# Altium schematic sheet Controller.SchDoc
size A4; SheetNumber: 3; SheetTotal: 3
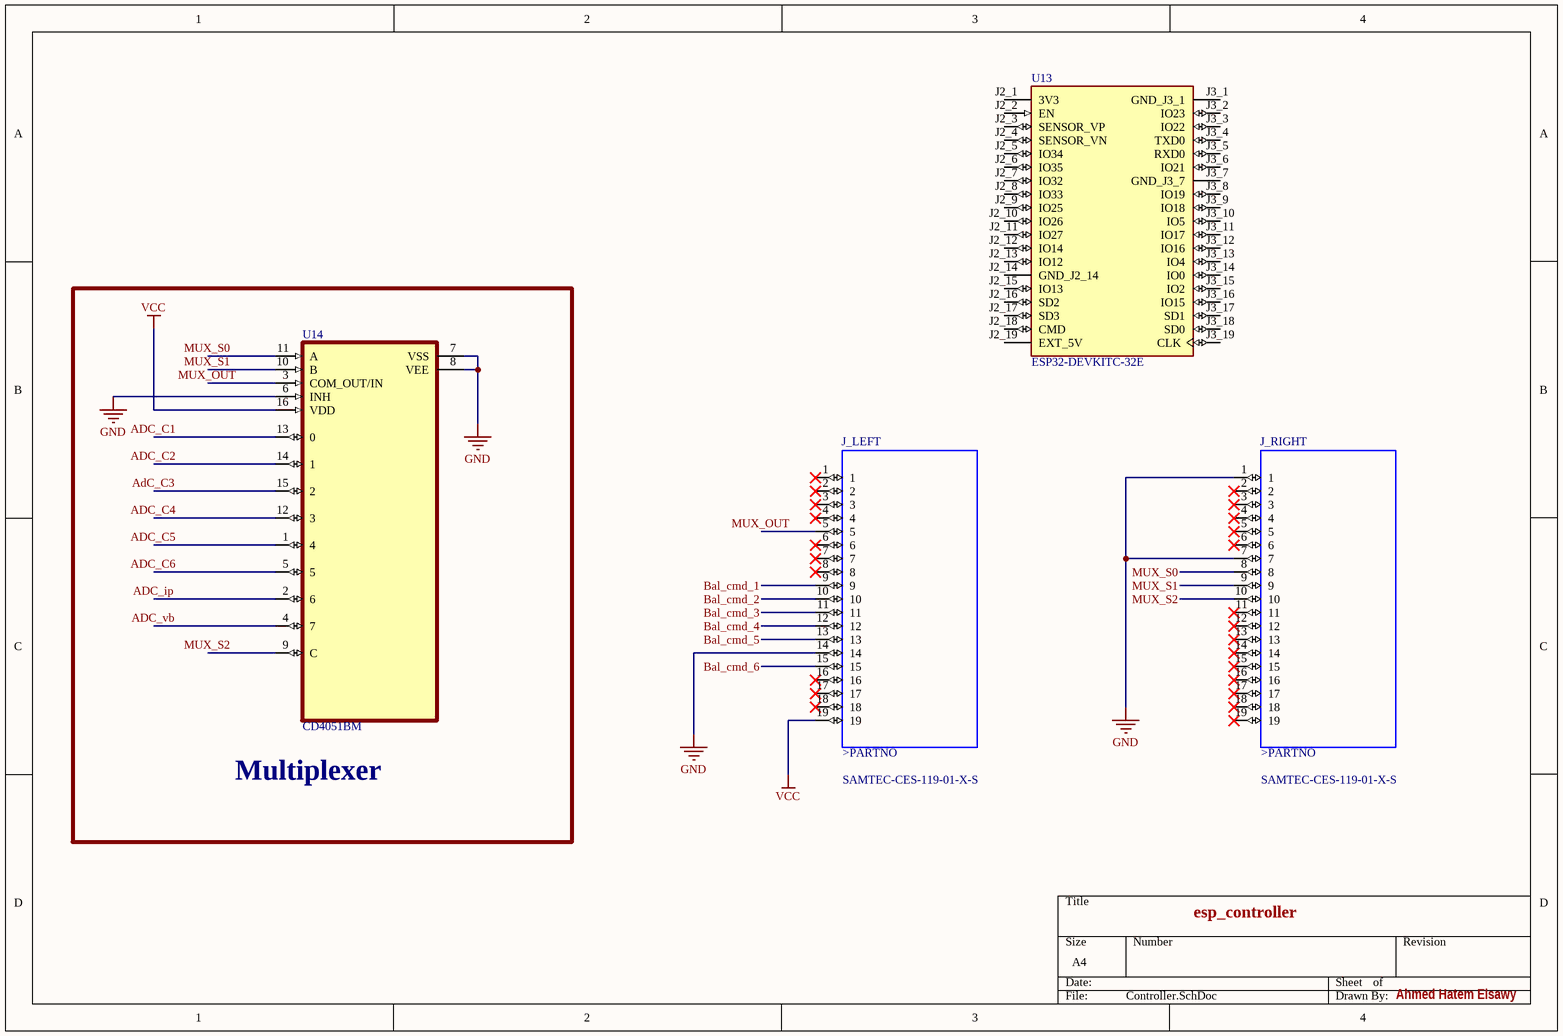
[diagram p0: Controller.SchDoc]

## Parts
J_LEFT  SAMTEC-CES-119-01-X-S  [SAMTEC-CES-119-01-X-S]  (value not drawn)
J_RIGHT  SAMTEC-CES-119-01-X-S  [SAMTEC-CES-119-01-X-S]  (value not drawn)
U13  ESP32-DEVKITC-32E  [MODULE_ESP32-DEVKITC-32E]
U14  CD4051BM  [SOIC127P600X175-16N]

## Blocks framed on the sheet
Multiplexer: U14

## Nets
GND: J_LEFT.14 J_RIGHT.1 J_RIGHT.7 U14.6(INH) U14.7(VSS) U14.8(VEE)
VCC: J_LEFT.19 U14.16(VDD)
ADC_C1: U14.13(0)
ADC_C2: U14.14(1)
AdC_C3: U14.15(2)
ADC_C4: U14.12(3)
ADC_C5: U14.1(4)
ADC_C6: U14.5
ADC_ip: U14.2(6)
ADC_vb: U14.4(7)
Bal_cmd_1: J_LEFT.9
Bal_cmd_2: J_LEFT.10
Bal_cmd_3: J_LEFT.11
Bal_cmd_4: J_LEFT.12
Bal_cmd_5: J_LEFT.13
Bal_cmd_6: J_LEFT.15
MUX_OUT: J_LEFT.5 U14.3(COM_OUT/IN)
MUX_S0: J_RIGHT.8 U14.11(A)
MUX_S1: J_RIGHT.9 U14.10(B)
MUX_S2: J_RIGHT.10 U14.9(C)

Not connected (* = marked no-connect by the designer): J_LEFT 1* 2* 3* 4* 6* 7* 8* 16* 17* 18*; J_RIGHT 2* 3* 4* 5* 6* 11* 12* 13* 14* 15* 16* 17* 18* 19*; U13 J2_1(3V3) J2_2(EN) J2_3(SENSOR_VP) J2_4(SENSOR_VN) J2_5(IO34) J2_6(IO35) J2_7(IO32) J2_8(IO33) J2_9(IO25) J2_10(IO26) J2_11(IO27) J2_12(IO14) J2_13(IO12) J2_14(GND_J2_14) J2_15(IO13) J2_16(SD2) J2_17(SD3) J2_18(CMD) J2_19(EXT_5V) J3_1(GND_J3_1) J3_2(IO23) J3_3(IO22) J3_4(TXD0) J3_5(RXD0) J3_6(IO21) J3_7(GND_J3_7) J3_8(IO19) J3_9(IO18) J3_10(IO5) J3_11(IO17) J3_12(IO16) J3_13(IO4) J3_14(IO0) J3_15(IO2) J3_16(IO15) J3_17(SD1) J3_18(SD0) J3_19(CLK)

## Notes on the sheet
- esp_controller
- Ahmed Hatem Elsawy
- (in symbol SAMTEC-CES-119-01-X-S) >PARTNO

## Library data of the parts
U13 = ESP32-DEVKITC-32E: The ESP32-DEVKITC-32E transceiver evaluation board from Espressif Systems is a powerful development tool for wireless communication technologies. It supports 802.11 b/g/n Wi-Fi and BluetoothÂ® Smart Ready 4.x (BLE) dual-mode at 2.4GHz, making it ideal for; SnapEDA_Link: https://www.snapeda.com/parts/ESP32-DEVKITC-32E/Espressif+Systems/view-part/?ref=snap; Package: None; Value: *; MF: Espressif Systems; MP: ESP32-DEVKITC-32E; Check_prices: https://www.snapeda.com/parts/ESP32-DEVKITC-32E/Espressif+Systems/view-part/?ref=eda
U14 = CD4051BM: 20-V, 8:1, 1-channel analog multiplexer with logic-level conversion; MF: Texas Instruments; SnapEDA_Link: https://www.snapeda.com/parts/CD4051BM/Texas+Instruments/view-part/?ref=snap; Package: SOIC-16 Texas Instruments; Value: *; MP: CD4051BM; Check_prices: https://www.snapeda.com/parts/CD4051BM/Texas+Instruments/view-part/?ref=eda
J_LEFT J_RIGHT = SAMTEC-CES-119-01-X-S: Package: None; Price: None; Value: *; MP: SAMTEC-CES-119-01-X-S; Availability: Unavailable